# EAGLE design motor-1 (EAGLE 6.5.0)
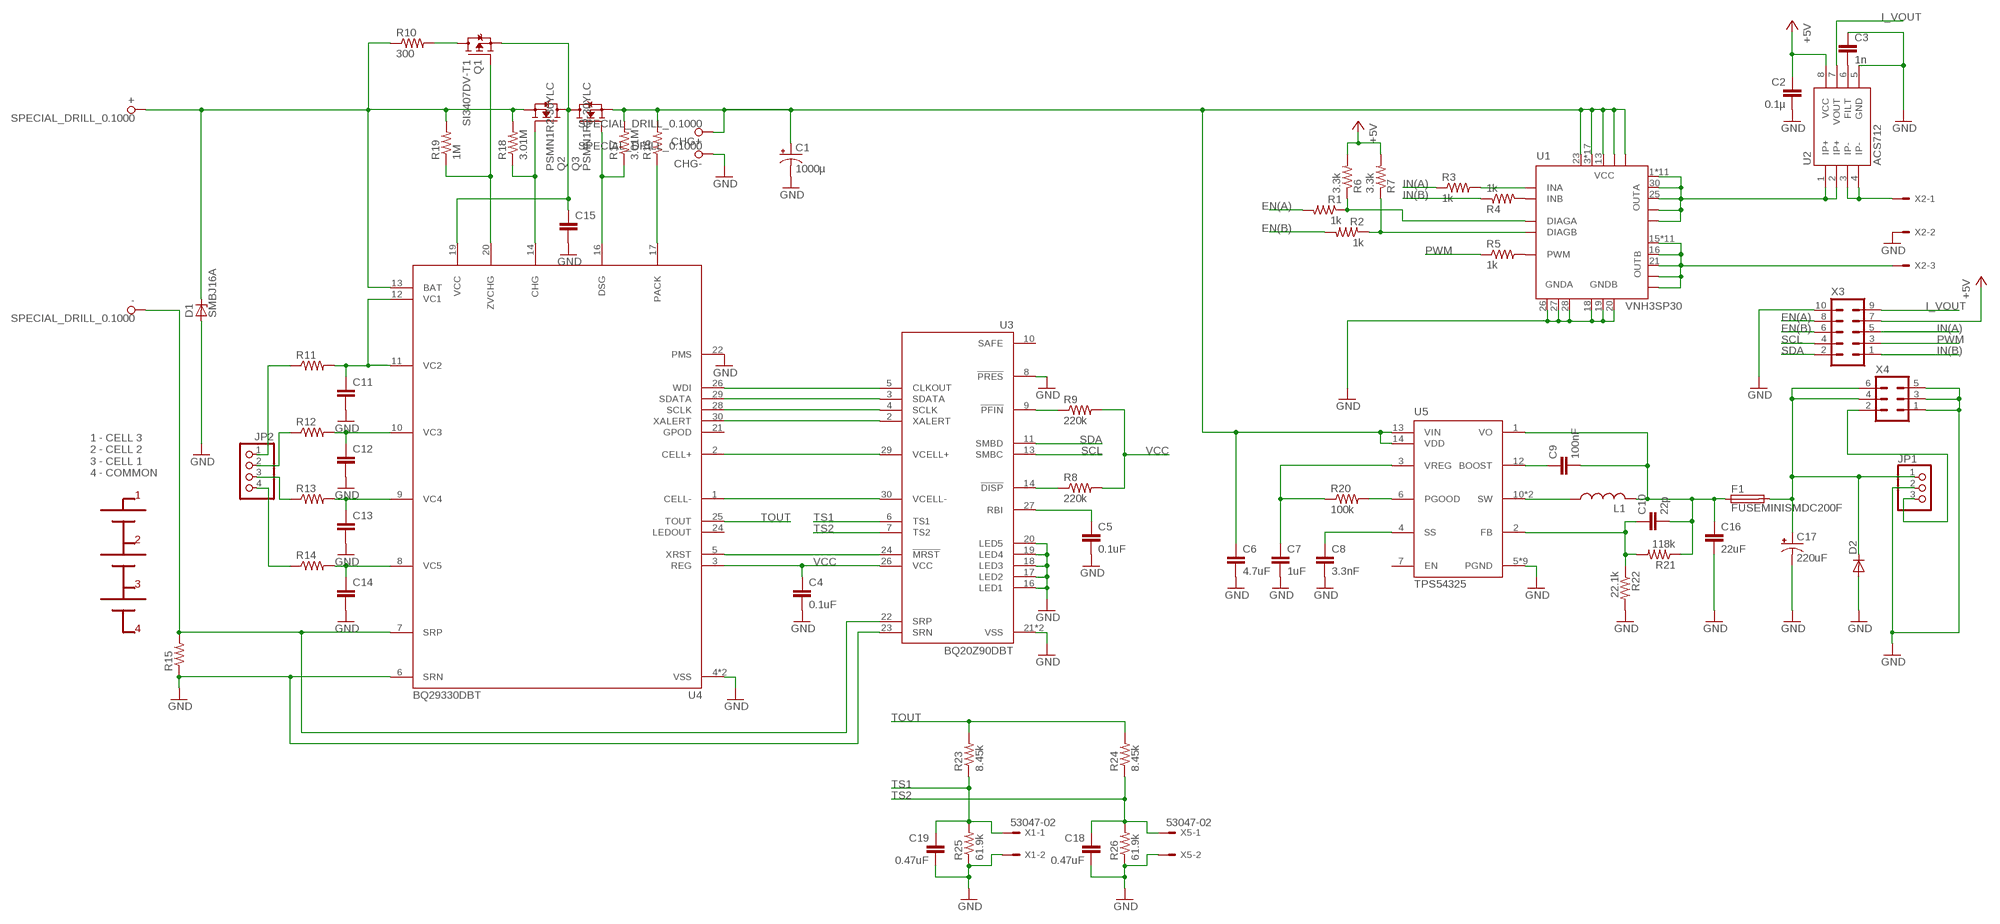
[diagram p0: schematic, sheet 1]

## Parts
+  SPECIAL_DRILL_0.1000  [PAD_0.1000]
-  SPECIAL_DRILL_0.1000  [PAD_0.1000]
C1  1000µ  CPOL-USE5-13  [E5-13]
C2  0.1µ  C-EUC0805  [C0805]
C3  1n  C-EUC0805  [C0805]
C4  0.1uF  C-EUC0603  [C0603]
C5  0.1uF  C-EUC0603  [C0603]
C6  4.7uF  C-EUC1206  [C1206]
C7  1uF  C-EUC0805  [C0805]
C8  3.3nF  C-EUC0805  [C0805]
C9  100nF  C-EUC0805  [C0805]
C10  22p  C-EUC0805  [C0805]
C11  C-EUC0603  [C0603]
C12  C-EUC0603  [C0603]
C13  C-EUC0603  [C0603]
C14  C-EUC0603  [C0603]
C15  C-EUC0603  [C0603]
C16  22uF  C-EUC3225  [C3225]
C17  220uF  CPOL-USE3.5-8  [E3,5-8]
C18  0.47uF  C-EUC0603  [C0603]
C19  0.47uF  C-EUC0603  [C0603]
CHG+  SPECIAL_DRILL_0.1000  [PAD_0.1000]
CHG-  SPECIAL_DRILL_0.1000  [PAD_0.1000]
D1  SMBJ16A  ZENER-DIODESMB  [SMB]
D2  DIODE-DO214AC  [DO214AC]
F1  FUSEMINISMDC200F  [MINISMDC200F]
JP1  PINHD-1X3  [1X03]
JP2  PINHD-1X4  [1X04]
L1  L-USXAL50XX  [XAL50XX]
Q1  SI3407DV-T1  [SOT23-6]
Q2  PSMN1R2-30YLC  [LFPAK]
Q3  PSMN1R2-30YLC  [LFPAK]
R1  1k  R-US_R0805  [R0805]
R2  1k  R-US_R0805  [R0805]
R3  1k  R-US_R0805  [R0805]
R4  1k  R-US_R0805  [R0805]
R5  1k  R-US_R0805  [R0805]
R6  3.3k  R-US_R0805  [R0805]
R7  3.3k  R-US_R0805  [R0805]
R8  220k  R-US_R0603  [R0603]
R9  220k  R-US_R0603  [R0603]
R10  300  R-US_R2512  [R2512]
R11  R-US_R0603  [R0603]
R12  R-US_R0603  [R0603]
R13  R-US_R0603  [R0603]
R14  R-US_R0603  [R0603]
R15  R-US_R1210  [R1210]
R16  R-US_R0603  [R0603]
R17  3.01M  R-US_R0603  [R0603]
R18  3.01M  R-US_R0603  [R0603]
R19  1M  R-US_R0603  [R0603]
R20  100k  R-US_R0805  [R0805]
R21  118k  R-US_R0805  [R0805]
R22  22.1k  R-US_R0805  [R0805]
R23  8.45k  R-US_R0603  [R0603]
R24  8.45k  R-US_R0603  [R0603]
R25  61.9k  R-US_R0603  [R0603]
R26  61.9k  R-US_R0603  [R0603]
U1  VNH3SP30  [MULTIPOWERSO-30]
U2  ACS712  [SO08]
U3  BQ20Z90DBT  [DBT_R-PDSO-G30]
U4  BQ29330DBT  [DBT_R-PDSO-G30]
U5  TPS54325  [HTSSOP14PWP]
X1  53047-02  [53047-02]
X2  KK-156-3  [KK-156-3]
X3  ML10  [ML10]
X4  ML6  [ML6]
X5  53047-02  [53047-02]

## Nets
+5V: C2.1 R6.2 R7.2 U2.8(VCC) X3.7
EN(A): R1.2 X3.8
EN(B): R2.2 X3.6
GND: C1.- C2.2 C3.1 C4.2 C5.2 C6.2 C7.2 C8.2 C11.2 C12.2 C13.2 C14.2 C15.2 C16.2 C17.- C18.2 C19.2 CHG-.1 D1.A D2.A JP1.2 R15.1 R22.2 R25.1 R26.1 U1.18(GNDB) U1.19(GNDB) U1.20(GNDB) U1.26(GNDA) U1.27(GNDA) U1.28(GNDA) U2.5(GND) U3.8(!PRES) U3.16(LED1) U3.17(LED2) U3.18(LED3) U3.19(LED4) U3.20(LED5) U3.21(VSS) U3.23(SRN) U3.25(VSS) U4.4(VSS) U4.6(SRN) U4.22(PMS) U4.23(VSS) U5.5(PGND) U5.8(PGND) U5.9(PGND) U5.EXP1(PGND) U5.EXP(PGND) U5.P$1(PGND) U5.P$2(PGND) U5.P$3(PGND) U5.P$4(PGND) X1.2 X2.2 X3.10 X4.1 X4.3 X4.5 X5.2
GND_P: -.1 R15.2 U3.22(SRP) U4.7(SRP)
I_VOUT: U2.7(VOUT) X3.9
IN(A): R3.1 X3.5
IN(B): R4.1 X3.1
N$1 [power]: U1.15(OUTB) U1.16(OUTB) U1.21(OUTB) U1.OUTB U1.OUTB1(OUTB) U1.OUTB2(OUTB) U1.OUTB3(OUTB) U1.OUTB4(OUTB) U1.OUTB5(OUTB) U1.OUTB6(OUTB) U1.OUTB7(OUTB) U1.OUTB8(OUTB) U1.OUTB9(OUTB) U1.OUTB10(OUTB) U1.OUTB@1(OUTB) X2.3
N$2 [power]: U1.1(OUTA) U1.25(OUTA) U1.30(OUTA) U1.OUTA U1.OUTA1(OUTA) U1.OUTA2(OUTA) U1.OUTA3(OUTA) U1.OUTA4(OUTA) U1.OUTA5(OUTA) U1.OUTA6(OUTA) U1.OUTA7(OUTA) U1.OUTA8(OUTA) U1.OUTA9(OUTA) U1.OUTA10(OUTA) U1.OUTA@1(OUTA) U2.1(IP+) U2.2(IP+)
N$3: R3.2 U1.5(INA)
N$4: R4.2 U1.11(INB)
N$6: U3.5(CLKOUT) U4.26(WDI)
N$7: R1.1 R6.1 U1.6(DIAGA)
N$8: R2.1 R7.1 U1.10(DIAGB)
N$9: U2.3(IP-) U2.4(IP-) X2.1
N$10: U3.3(SDATA) U4.29(SDATA)
N$11: C3.2 U2.6(FILT)
N$12: U3.4(SCLK) U4.28(SCLK)
N$13: U3.2(XALERT) U4.30(XALERT)
N$14: U3.29(VCELL+) U4.2(CELL+)
N$15: U3.30(VCELL-) U4.1(CELL-)
N$16: U3.24(!MRST) U4.5(XRST)
N$17: C17.+ D2.C F1.2 JP1.1 X4.4 X4.6
N$18: R5.2 U1.8(PWM)
N$19: JP2.2 R12.1
N$20: JP2.1 R11.1
N$21: C11.1 R11.2 U4.11(VC2) U4.12(VC1)
N$22: C12.1 R12.2 U4.10(VC3)
N$23: JP2.3 R13.1
N$24: C13.1 R13.2 U4.9(VC4)
N$25: JP2.4 R14.1
N$26: C14.1 R14.2 U4.8(VC5)
N$27: R16.1 U4.17(PACK)
N$28: Q1.1(D1) Q1.2(D1) Q1.5(D1) Q1.6(D1) R10.2
N$29: C5.1 U3.27(RBI)
N$30: Q3.4(G) R17.1 U4.16(DSG)
N$31: C15.1 Q1.4(S1) Q2.P$1(D) Q2.P$2(D) Q2.P$3(D) Q3.P$1(D) Q3.P$2(D) Q3.P$3(D) U4.19(VCC)
N$32: Q2.4(G) R18.1 U4.14(CHG)
N$33: Q1.3(G1) R19.1 U4.20(ZVCHG)
N$34: +.1 D1.C Q2.1(S) Q2.2(S) Q2.3(S) R10.1 R18.2 R19.2 U4.13(BAT)
N$35: R8.1 U3.14(!DISP)
N$36: R9.1 U3.9(!PFIN)
N$37: C7.1 R20.1 U5.3(VREG)
N$38: R20.2 U5.6(PGOOD)
N$39: C8.1 U5.4(SS)
N$40: L1.1 U5.10(SW) U5.11(SW)
N$41: C9.2 C10.2 C16.1 F1.1 L1.2 R21.1 U5.1(VO)
N$42: C9.1 U5.12(BOOST)
N$43: C10.1 R21.2 R22.1 U5.2(FB)
PWM: R5.1 X3.3
S_CTL: JP1.3 X4.2
SCL: U3.13(SMBC) X3.4
SDA: U3.11(SMBD) X3.2
TOUT: R23.2 R24.2 U4.25(TOUT)
TS1: C19.1 R23.1 R25.2 U3.6(TS1) X1.1
TS2: C18.1 R24.1 R26.2 U3.7(TS2) X5.1
VBAT: C1.+ C6.1 CHG+.1 Q3.1(S) Q3.2(S) Q3.3(S) R16.2 R17.2 U1.3(VCC) U1.13(VCC) U1.23(VCC) U1.VCC U1.VCC1(VCC) U1.VCC2(VCC) U1.VCC3(VCC) U1.VCC4(VCC) U1.VCC5(VCC) U1.VCC6(VCC) U1.VCC7(VCC) U1.VCC8(VCC) U1.VCC9(VCC) U1.VCC10(VCC) U1.VCC11(VCC) U1.VCC12(VCC) U1.VCC13(VCC) U1.VCC14(VCC) U1.VCC15(VCC) U1.VCC16(VCC) U1.VCC@1(VCC) U5.13(VIN) U5.14(VDD)
VCC: C4.1 R8.2 R9.2 U3.26(VCC) U4.3(REG)
Unconnected: U3.10(SAFE) U4.21(GPOD) U4.24(LEDOUT) U5.7(EN)

## Notes on the sheet
- 1 - CELL 3
  2 - CELL 2
  3 - CELL 1
  4 - COMMON
- 1
- 2
- 3
- 4

## Library data of the parts
+ - CHG+ CHG- = special-drill:SPECIAL_DRILL_: Special drills
C1 C17 = rcl:CPOL-US: POLARIZED CAPACITOR, American symbol
C2-C16 C18 C19 = rcl:C-EU: CAPACITOR, European symbol
D1 = diode:ZENER-DIODE: Z-Diode
D2 = diode:DIODE-: DIODE
F1 = miniSMDC200F:FUSE
JP1 = pinhead:PINHD-1X3: PIN HEADER
JP2 = pinhead:PINHD-1X4: PIN HEADER
L1 = inductors:L-US: INDUCTOR, American symbol
Q1 = transistors:SI3407DV
Q2 Q3 = transistors:PSMN1R2-30YLC
R1-R26 = rcl:R-US_: RESISTOR, American symbol
U1 = VNH3SP30:VNH3SP30: FULLY INTEGRATED H-BRIDGE MOTOR DRIVER Source: http://pdf1.alldatasheet.com/datasheet-pdf/view/84563/STMICROELECTRONICS/VNH3SP30.html; MPN: VNH3SP30-E; OC_FARNELL: 1739420; OC_NEWARK: 33R1486
U2 = SparkFun-AnalogIC:ACS712: Hall-effect-based isolated linear current sensor
U3 = texas-1:BQ20Z90
U4 = texas-1:BQ29330
U5 = TPS54325:TPS54325
X1 X5 = con-molex:53?-02: CONNECTOR wire to board 1.25 mm (.049 inch) pitch header; MF: MOLEX; MPN: 53047-0210; OC_FARNELL: 9733051; OC_NEWARK: 57H4701
X2 = con-molex:KK-156-3: KK 156 HEADER Source: http://www.molex.com/pdm_docs/sd/026604100_sd.pdf; OC_FARNELL: unknown; OC_NEWARK: unknown
X3 = con-ml:ML10: HARTING; OC_FARNELL: unknown; OC_NEWARK: unknown
X4 = con-harting-ml:ML6: HARTING; OC_FARNELL: unknown; OC_NEWARK: unknown

## Net classes
1 power: clearance 0.003 mm

## Board
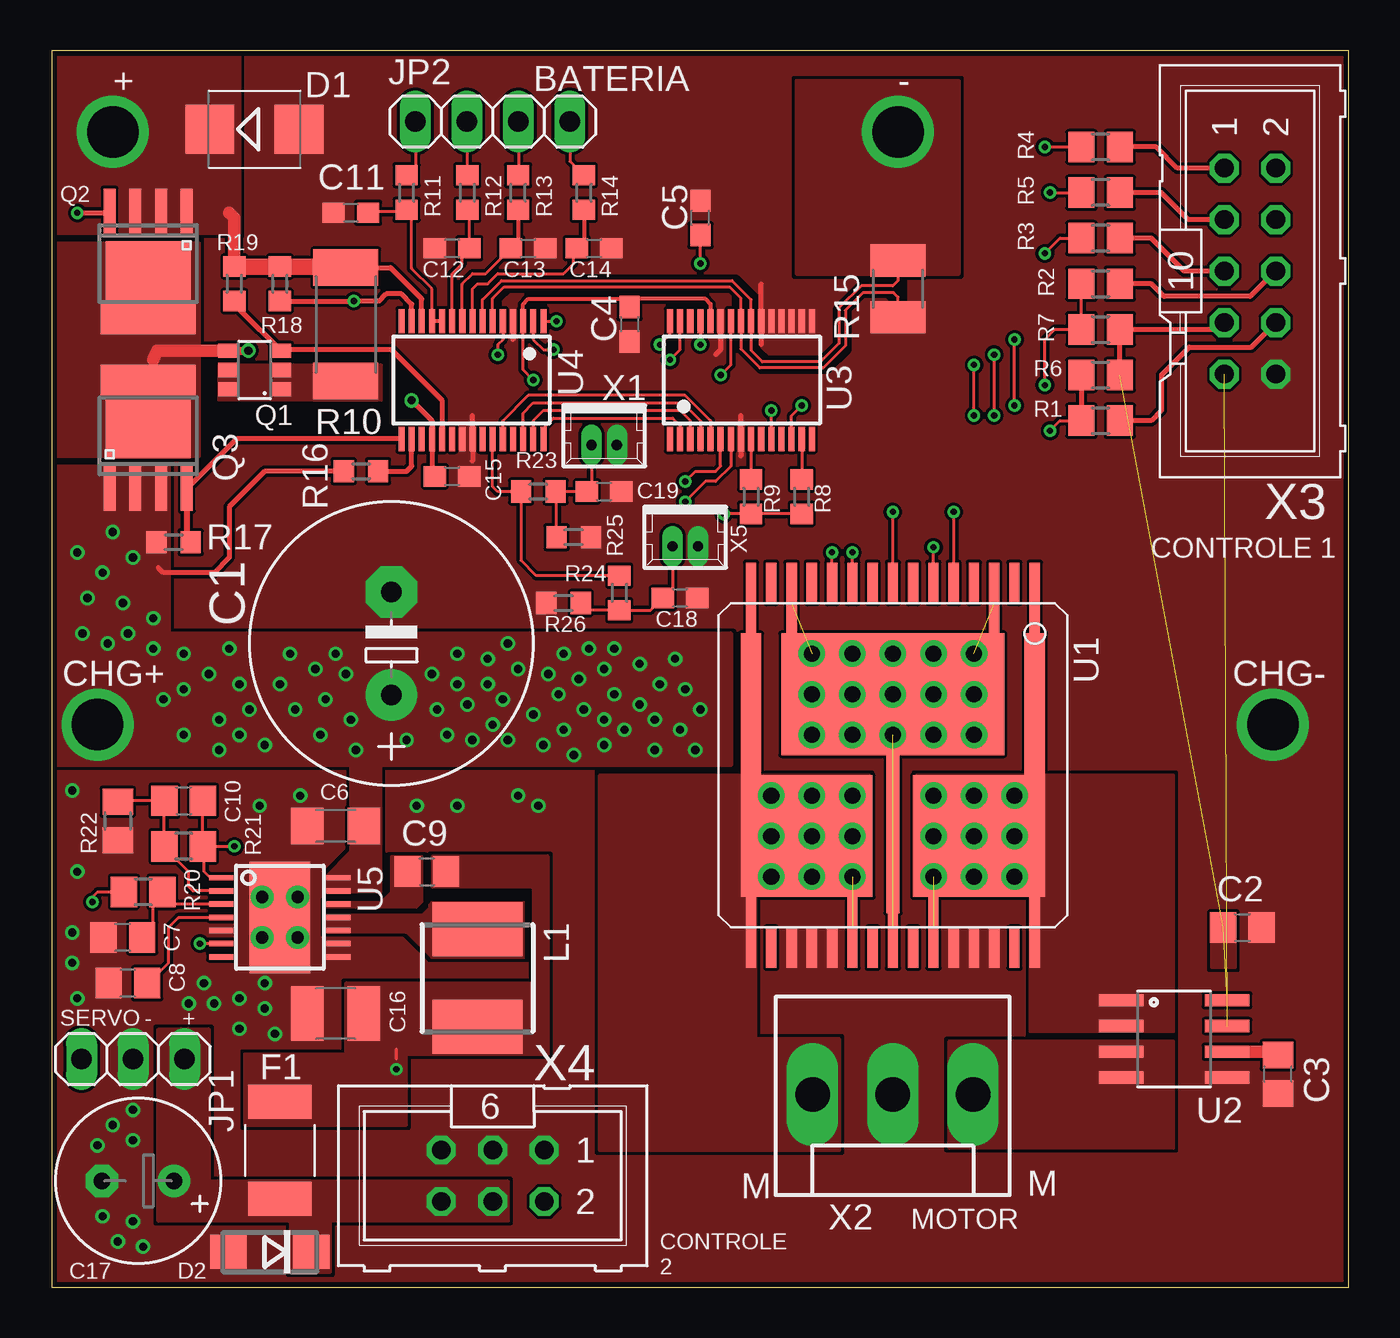
[diagram p1: board, top side]
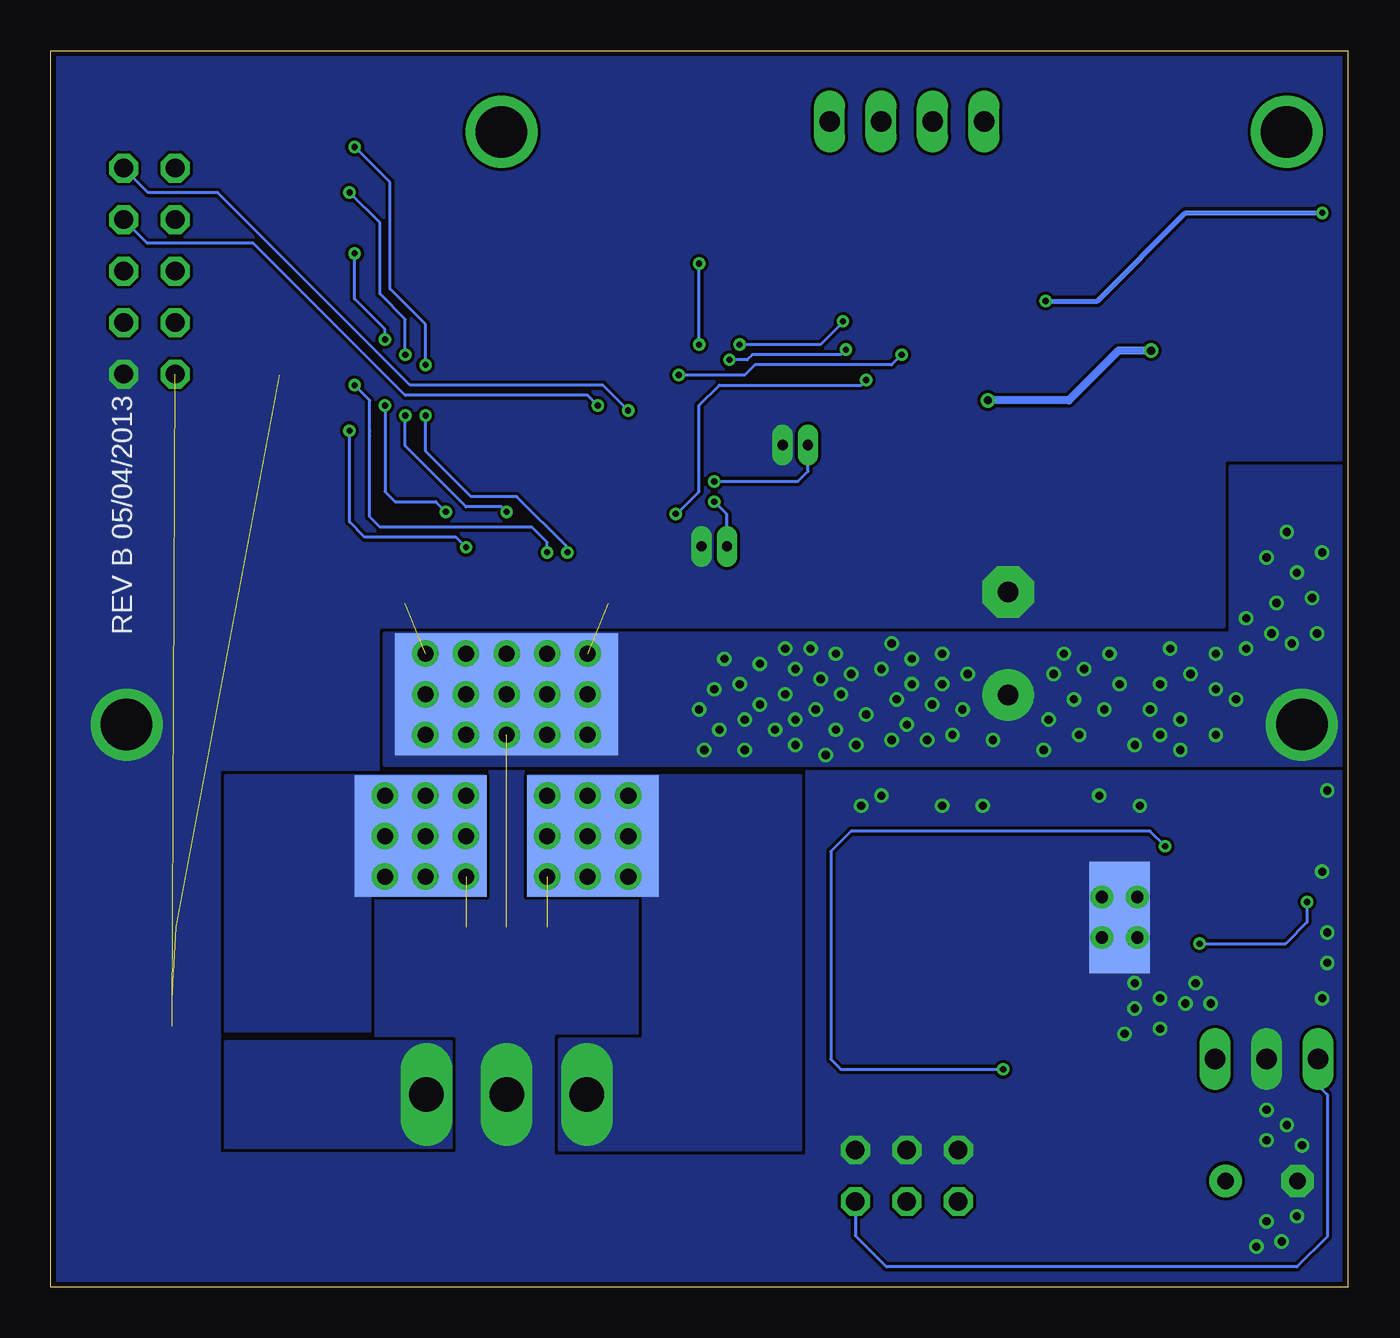
[diagram p2: board, bottom side, seen from below]

Size 64 x 61 mm. Coordinates in mm from the lower left corner, seen from the top.
Outline: 64,0 64,61 0,61 0,0 64,0
Copper layers (1*16): Top 0.035mm / dielectric 1.5mm / Bottom 0.035mm
Design rules "Fusion_eagle_rule_v1.1": minimum track width 6mil, minimum drill 12mil, track to track 6mil, track to pad 6mil, pad to pad 6mil, via to via 6mil, smd to smd 0mil, copper to edge 10mil, drill to drill 10mil, minimum pad ring 10mil, minimum via ring 6mil, stop-mask expansion 2mil, vias tented up to drill 100mil, thermal gap 10mil
tRestrict: area 21,45.2 to 42,50

### Footprints (pad centres in the part's own frame; a part is rotated, then mirrored left to right if it is on the bottom)
PAD_0.1000 = drill 2.54 pad 2.54: 1 0,0
E5-13 = drill 1.016 pad 2.54: + -2.54,0 | drill 1.016 pad 2.54 octagon: - 2.54,0
C0805 = smd 1.3 x 1.5: 1 -0.95,0; 2 0.95,0
C0603 = smd 1.1 x 1: 1 -0.85,0; 2 0.85,0
C1206 = smd 1.6 x 1.8: 1 -1.4,0; 2 1.4,0
C3225 = smd 1.6 x 2.7: 1 -1.4,0; 2 1.4,0
E3,5-8 = drill 0.813 pad 1.6: + -1.778,0 | drill 0.813 pad 1.6 octagon: - 1.778,0
SMB = smd 2.4 x 2.4: A 2.2,0; C -2.2,0
DO214AC = smd 1.8 x 1.7: A 2.05,0; C -2.05,0
MINISMDC200F = smd 1.68 x 3.15: 1 -2.39,0; 2 2.39,0
1X03 = drill 1.016 long: 1 -2.54,0; 2 0,0; 3 2.54,0
1X04 = drill 1.016 long: 1 -3.81,0; 2 -1.27,0; 3 1.27,0; 4 3.81,0
XAL50XX = smd 2.68 x 4.44: 1 -2.405,0; 2 2.405,0
SOT23-6 = smd 0.7 x 1: 1 -0.95,-1.3; 2 0,-1.3; 3 0.95,-1.3; 4 0.95,1.3; 5 0,1.3; 6 -0.95,1.3
LFPAK = smd 0.6 x 2.2: 1 -1.905,-2.6; 2 -0.635,-2.6; 3 0.635,-2.6; 4 1.905,-2.6 | smd 4.2 x 1.1: P$1 0,-0.55 | smd 4.2 x 2: P$2 0,1 | smd 4.7 x 1.5: P$3 0,2.75
R0805 = smd 1.3 x 1.5: 1 -0.95,0; 2 0.95,0
R0603 = smd 1 x 1.1: 1 -0.85,0; 2 0.85,0
R2512 = smd 1.8 x 3.2: 1 -2.8,0; 2 2.8,0
R1210 = smd 1.6 x 2.7: 1 -1.4,0; 2 1.4,0
MULTIPOWERSO-30 = smd 0.508 x 12: 1 -7,-4; 15 7,-4; 16 7,4; 30 -7,4 | smd 0.508 x 2: 2 -6,-9; 4 -4,-9; 5 -3,-9; 6 -2,-9; 7 -1,-9; 8 0,-9; 9 1,-9; 10 2,-9; 11 3,-9; 12 4,-9; 14 6,-9; 17 6,9; 18 5,9; 19 4,9; 20 3,9; 22 1,9; 24 -1,9; 26 -3,9; 27 -4,9; 28 -5,9; 29 -6,9 | smd 0.508 x 4: 3 -5,-8; 13 5,-8; 21 2,8; 23 0,8; 25 -2,8 | smd 6.5 x 6 bottom: OUTA -4.25,3.5; OUTB 4.25,3.5 | smd 6.5 x 6: OUTA1 -4.25,3.5; OUTB1 4.25,3.5 | drill 0.8: OUTA2 -6,5.5; OUTA3 -4,5.5; OUTA4 -2,5.5; OUTA5 -6,3.5; OUTA6 -4,3.5; OUTA7 -2,3.5; OUTA8 -2,1.5; OUTA9 -4,1.5; OUTA10 -6,1.5; OUTB2 2,5.5; OUTB3 4,5.5; OUTB4 6,5.5; OUTB5 6,3.5; OUTB6 4,3.5; OUTB7 2,3.5; OUTB8 2,1.5; OUTB9 4,1.5; OUTB10 6,1.5; VCC2 -4,-1.5; VCC3 -2,-1.5; VCC4 0,-1.5; VCC5 2,-1.5; VCC6 4,-1.5; VCC7 4,-3.5; VCC8 2,-3.5; VCC9 0,-3.5; VCC10 -2,-3.5; VCC11 -4,-3.5; VCC12 -4,-5.5; VCC13 -2,-5.5; VCC14 0,-5.5; VCC15 2,-5.5; VCC16 4,-5.5 | smd 1 x 7.5: OUTA@1 -7,-2.755; OUTB@1 7,-2.755 | smd 11 x 6 bottom: VCC 0,-3.5 | smd 11 x 6: VCC1 0,-3.5 | smd 0.65 x 8.3: VCC@1 0,3.145
SO08 = smd 0.61 x 2.21: 1 -1.905,-2.616; 2 -0.635,-2.616; 3 0.635,-2.616; 4 1.905,-2.616; 5 1.905,2.616; 6 0.635,2.616; 7 -0.635,2.616; 8 -1.905,2.616
DBT_R-PDSO-G30 = smd 0.3 x 1.2: 1 -3.5,-2.9; 2 -3,-2.9; 3 -2.5,-2.9; 4 -2,-2.9; 5 -1.5,-2.9; 6 -1,-2.9; 7 -0.5,-2.9; 8 0,-2.9; 9 0.5,-2.9; 10 1,-2.9; 11 1.5,-2.9; 12 2,-2.9; 13 2.5,-2.9; 14 3,-2.9; 15 3.5,-2.9; 16 3.5,2.9; 17 3,2.9; 18 2.5,2.9; 19 2,2.9; 20 1.5,2.9; 21 1,2.9; 22 0.5,2.9; 23 0,2.9; 24 -0.5,2.9; 25 -1,2.9; 26 -1.5,2.9; 27 -2,2.9; 28 -2.5,2.9; 29 -3,2.9; 30 -3.5,2.9
HTSSOP14PWP = smd 0.27 x 1.2: 1 -1.95,-2.9; 2 -1.3,-2.9; 3 -0.65,-2.9; 4 0,-2.9; 5 0.65,-2.9; 6 1.3,-2.9; 7 1.95,-2.9; 8 1.95,2.9; 9 1.3,2.9; 10 0.65,2.9; 11 0,2.9; 12 -0.65,2.9; 13 -1.3,2.9; 14 -1.95,2.9 | smd 5.5 x 3 bottom: EXP 0,0 | smd 5.5 x 3: EXP1 0,0 | drill 0.61: P$1 -1,0.875; P$2 -1,-0.875; P$3 1,-0.875; P$4 1,0.875
53047-02 = drill 0.5 pad 0.698 long: 1 0.625,0.45; 2 -0.625,0.45
KK-156-3 = drill 1.7 pad 2.184 long: 1 -3.96,0; 2 0,0; 3 3.96,0
ML10 = drill 0.914 octagon: 1 -5.08,-1.27; 2 -5.08,1.27; 3 -2.54,-1.27; 4 -2.54,1.27; 5 0,-1.27; 6 0,1.27; 7 2.54,-1.27; 8 2.54,1.27; 9 5.08,-1.27; 10 5.08,1.27
ML6 = drill 0.914 octagon: 1 -2.54,-1.27; 2 -2.54,1.27; 3 0,-1.27; 4 0,1.27; 5 2.54,-1.27; 6 2.54,1.27

### Placement (x,y rotation side)
+  3,57 0 top
-  41.75,57 0 top
C1  16.75,31.75 90 top
C2  58.75,17.75 0 top
C3  60.5,10.5 90 top
C4  28.5,47.5 270 top
C5  32,52.75 90 top
C6  14,22.75 180 top
C7  3.5,17.25 180 top
C8  3.75,15 180 top
C9  18.5,20.5 0 top
C10  6.5,24 0 top
C11  14.75,53 180 top
C12  19.75,51.25 180 top
C13  23.5,51.25 0 top
C14  26.75,51.25 0 top
C15  19.75,40 0 top
C16  14,13.5 180 top
C17  4.25,5.25 180 top
C18  31,34 0 top
C19  27.25,39.25 0 top
CHG+  2.25,27.75 0 top
CHG-  60.25,27.75 0 top
D1  10,57.12 0 top
D2  10.75,1.75 180 top
F1  11.25,6.75 270 top
JP1  4,11.25 180 top
JP2  21.75,57.5 0 top
L1  21,15.25 270 top
Q1  10,45.25 90 top
Q2  4.75,50.5 180 top
Q3  4.75,42 0 top
R1  51.75,42.75 0 top
R2  51.75,49.5 0 top
R3  51.75,51.75 180 top
R4  51.75,56.25 180 top
R5  51.75,54 180 top
R6  51.75,45 0 top
R7  51.75,47.25 0 top
R8  37,39 270 top
R9  34.5,39 270 top
R10  14.5,47.5 270 top
R11  17.5,54 270 top
R12  20.5,54 270 top
R13  23,54 270 top
R14  26.25,54 270 top
R15  41.75,49.25 90 top
R16  15.25,40.25 180 top
R17  6,36.75 180 top
R18  11.25,49.5 90 top
R19  9,49.5 90 top
R20  4.5,19.5 180 top
R21  6.5,21.75 180 top
R22  3.25,23 270 top
R23  24,39.25 180 top
R24  28,34.25 90 top
R25  25.75,37 180 top
R26  25.25,33.75 0 top
U1  41.5,25.75 180 top
U2  55.38,12.25 270 top
U3  34,44.75 0 top
U4  20.75,44.75 180 top
U5  11.25,18.25 270 top
X1  27.25,42 180 top
X2  41.5,9.5 180 top
X3  59.12,50.12 270 top
X4  21.75,5.5 180 top
X5  31.25,37 180 top

### Tracks (layer width: path | path; a pad name or v marks a point on that pad's centre or on a via)
+5V  (2 unrouted)
  Top 0.254: X3.7 57.52,47.25 R7.2 R6.2
  pour Top (isolate 0.254, no thermals): 57.25,18.38 58.38,18.38 58.38,15.75 57.25,15.75
EN(A)
  Top 0.254: X3.8 59.19,46.38 56.12,46.38 54.75,45 54.75,43.25 54.25,42.75 R1.2
EN(B)
  Top 0.254: X3.6 60.38,50.12 59.12,48.88 54.88,48.88 54.25,49.5 R2.2
GND  (via drill 0.41)
  Top 0.152: R15.1 41.75,48.85 41.53,49.07 40.03,49.07 39.15,48.19 39.15,46.44 38.06,45.35 34.94,45.35 34,46.28 U3.23 34,48.78 33.44,49.35 22.31,49.35 21.75,48.78 U4.6
  Top 0.254: 20.75,40.75 U4.23 20.75,43 | U4.4 22.75,46.75 | 35,46.5 U3.21 35,49.5 | U3.25 33,46.25 32.75,46 | 34,41 U3.8 34,43
  other vias: 10.25,23.75 12.25,24.25 1,24.5 1.25,20.5 1,16 1,17.5 1.25,14.25 8,14 9.25,12.75 9.25,14.25 11,12.5 10.5,13.75 7.5,15 4.5,2 3.25,2.25 2.5,3.5 4,3.25 2.25,7 4,7.25 3,8 4,8.75 10.5,15 6.75,14 18,23.75 20,23.75 23,24.25 24,23.75
  pour Top (isolate 0.13, rank 6, no thermals): 0,0 64,0 64,61 0,61
  pour Bottom (isolate 0.13, rank 6, no thermals): 0,0 64,0 64,61 0,61
GND_P
  Top 0.152: R15.2 41.75,49.65 41.5,49.4 39.94,49.4 38.85,48.31 38.85,46.56 37.94,45.65 35.06,45.65 34.5,46.22 U3.22 34.5,48.72 33.56,49.65 22.19,49.65 21.25,48.72 U4.7
  pour Top (no thermals): 36.75,50 44.75,50 44.75,59.5 36.75,59.5
I_VOUT  (1 unrouted)
IN(A)
  Top 0.254: X3.5 55.88,50.12 54.25,51.75 R3.1
IN(B)
  Top 0.254: X3.1 55.55,55.2 54.5,56.25 R4.1
N$1  (1 unrouted)
  pour Bottom (isolate 0.13, rank 2, no thermals): 40.38,25.25 27,25.25 27,6.75 38.88,6.75 38.88,12.25 34.75,12.25 34.75,20.38 40.38,20.38
  pour Top (isolate 0.13, rank 2, no thermals): 40.38,25.25 27,25.25 27,6.75 38.88,6.75 38.88,12.25 34.75,12.25 34.75,20.38 40.38,20.38
N$2  (1 unrouted)
  pour Bottom (isolate 0.13, no thermals): 42.62,25.25 42.62,20.38 48.25,20.38 48.25,12.62 55.38,12.62 55.38,25.25
  pour Top (isolate 0.13, no thermals): 42.62,25.25 42.62,20.38 48.25,20.38 48.25,12.62 55.38,12.62 55.38,25.25
N$3  (via drill 0.3)
  Top 0.152: U1.5 v44.5,38.25 | v47.5,43.5 v47.5,46.75 | v49,51 49.75,51.75 R3.2
  Bottom 0.152: v49,51 49,48.75 47.5,47.25 v47.5,46.75 | v47.5,43.5 47.5,39.25 47,38.75 45,38.75 v44.5,38.25
N$4  (via drill 0.3)
  Top 0.152: U1.11 v38.5,36.25 | v45.5,43 v45.5,45.5 | v49,56.25 R4.2
  Bottom 0.152: v38.5,36.25 38.5,36.5 41,39 43.25,39 45.5,41.25 v45.5,43 | v45.5,45.5 45.5,47.5 47.25,49.25 47.25,54.5 v49,56.25
N$6
  Top 0.152: U4.26 22.25,42.75 23.5,44 31.25,44 32.5,42.75 U3.5
N$7  (via drill 0.3)
  Top 0.152: U1.6 v43.5,36.5 | v49.25,42.25 49.75,42.75 R1.1
  Top 0.254: R6.1 R1.1
  Bottom 0.152: v43.5,36.5 44,37 48.5,37 49.25,37.75 v49.25,42.25
N$8  (via drill 0.3)
  Top 0.152: R2.1 R7.1 49.5,47.25 49,46.75 v49,44.5 | U1.10 v39.5,36.25
  Bottom 0.152: v39.5,36.25 39.5,36.75 40.25,37.5 47.75,37.5 48.25,38 48.25,42 48.25,42.25 48.25,43.75 v49,44.5
N$9
  pour Top (isolate 0.13, no thermals): 44.25,6.88 55.38,6.88 55.38,12.12 44.25,12.12
  pour Bottom (isolate 0.13, no thermals): 44.25,6.88 55.38,6.88 55.38,12.12 44.25,12.12
N$10
  Top 0.152: U3.3 31.5,42.75 31,43.25 24.25,43.25 23.75,42.75 U4.29
N$11
  Top 0.61: U2.6 60.34,11.62 C3.2
N$12
  Top 0.152: 23.25,42.75 U4.28 23.25,43.12 23.75,43.62 31.12,43.62 32,42.75 U3.4
N$13
  Top 0.152: U4.30 24.25,42.38 24.75,42.88 30.62,42.88 31,42.5 U3.2
N$14  (via drill 0.3)
  Top 0.152: v30.5,45.75 31,46.25 U3.29 | U4.2 23.75,46.75 24.25,46.25 v24.75,46.25
  Bottom 0.152: v30.5,45.75 29.62,45.75 29.38,46 25,46 v24.75,46.25
N$15  (via drill 0.3)
  Top 0.152: U4.1 v24.9,47.65 | v30,46.5 30.5,47 U3.30
  Bottom 0.152: v24.9,47.65 24.9,47.6 26,46.5 v30,46.5
N$16  (via drill 0.3)
  Top 0.152: v33,45 33.5,45.5 U3.24 | U4.5 22.25,46.75 22,46.5 v22,46
  Bottom 0.152: v33,45 29.75,45 29.25,45.5 22.5,45.5 v22,46
N$17
  pour Top (no thermals): 7.75,5.25 22.5,5.25 22.5,3.25 5.25,3.25 5.25,12.75 7.75,12.75
  pour Top (no thermals): 12,0.75 13.75,0.75 13.75,3.25 11.75,3.25 11.75,0.75
N$18  (via drill 0.3)
  Top 0.152: U1.8 v41.5,38.25 | v46.5,43 v46.5,46 | v49.25,54 R5.2
  Bottom 0.152: v41.5,38.25 41.75,38.5 43.5,38.5 46.5,41.5 v46.5,43 | v46.5,46 46.5,47.75 47.75,49 47.75,52.5 v49.25,54
N$19
  Top 0.152: JP2.2 20.48,54.87 R12.1
  Top 0.203: 20.73,54.87 R12.1
N$20
  Top 0.152: JP2.1 17.94,55.29 R11.1
N$21
  Top 0.152: U4.12 18.75,49.25 17.75,50.25 17.75,52.9 R11.2 | 17.6,53.05 15.65,53.05 C11.1
  Top 0.203: 17.6,53.05 R11.2 | U4.11 U4.12
N$22
  Top 0.152: U4.10 19.75,50 20.25,50.5 20.25,50.9 C12.1 20.6,53.05 R12.2
N$23
  Top 0.152: JP2.3 23.02,54.87 R13.1
N$24
  Top 0.152: U4.9 20.25,49.5 20.75,50 21.4,50 C13.1
  Top 0.203: R13.2 23,51.6 C13.1
N$25
  Top 0.152: JP2.4 25.56,55.54 R14.1
N$26
  Top 0.152: U4.8 20.75,49.25 21,49.5 21.5,49.5 22,50 25.25,50 25.75,50.5 25.75,51.1 C14.1
  Top 0.203: R14.2 26.25,51.6 C14.1
N$27
  Top 0.254: R16.1 17.5,40.25 17.75,40.5 U4.17
N$28
  pour Top (no thermals): 8.25,45.5 16.25,45.5 16.25,43.75 8.25,43.75
N$29  (via drill 0.3)
  Top 0.152: U3.27 v32,46.5 | v32,50.5 C5.1
  Bottom 0.152: v32,46.5 v32,50.5
N$30
  Top 0.254: Q3.4 9.11,41.85 U4.16
  Top 0.305: Q3.4 6.66,36.95 R17.1
N$31  (via drill 0.41)
  Top 0.254: 18.75,39.9 U4.19 18.75,42.75 v17.75,43.75
  Top 0.305: 18.75,39.9 C15.1
  Top 0.406: Q1.4 v9.7,46.2
  Top 0.61: Q1.4 5.2,46.2 5,45.75
  Bottom 0.406: v17.75,43.75 13.75,43.75 11.3,46.2 v9.7,46.2
  pour Top (isolate 0.13, no thermals): 7.25,51.5 7.25,41 0,41 0,51.5
N$32  (via drill 0.3)
  Top 0.254: U4.14 17.75,48.5 17.25,49 16.5,49 16.15,48.65 v14.9,48.65 R18.1 | v1.25,53 2.75,53 Q2.4
  Bottom 0.254: v1.25,53 8,53 12.35,48.65 v14.9,48.65
N$33
  Top 0.254: U4.20 19.25,43.75 16.75,46.25 11.35,46.25 Q1.3 9.25,48.25 9.25,48.4 R19.1
N$34
  Top 0.254: U4.13 18.25,48.75 16.7,50.3 R10.1
  Top 0.61: R19.2 9,52.75 8.75,53
  Top 0.813: R10.1 14.45,50.35 R18.2 R19.2
  pour Top (isolate 0.13, no thermals): 9.25,52 0,52 0,60.75 9.25,60.75
N$35
  Top 0.152: U3.14 R8.1
N$36
  Top 0.152: U3.9 R9.1
N$37
  Top 0.152: U5.3 6.05,18.9 R20.1 5,19.05 5,17.75 4.5,17.25 C7.1
N$38  (via drill 0.3)
  Top 0.152: U5.6 v7.3,16.95 | v2,19 2,19.25 2.25,19.5 R20.2
  Bottom 0.152: v7.3,16.95 3.05,16.95 2,18 v2,19
N$39
  Top 0.152: C8.1 4.75,15 5.75,16 5.75,17.75 6.25,18.25 U5.4
N$40
  pour Top (isolate 0.254, rank 2, no thermals): 13.5,18.5 18.25,18.5 18.75,19 23.25,19 23.25,16.25 18.75,16.25 17.5,17.5 13.5,17.5
N$41  (via drill 0.3)
  Top 0.152: U5.1 7.8,20.2 7.5,20.5 7.5,21.7 R21.1 | R21.1 v9,21.75 | 17,11.25 17,11.75 | R21.1 C10.2 | v17,10.75 16.75,10.75
  Bottom 0.152: v9,21.75 9.75,22.5 24.5,22.5 25.5,21.5 25.5,11.25 25,10.75 v17,10.75
  pour Top (no thermals): 18.75,19.75 23.75,19.75 23.75,15 14.5,15 14.5,11.5 24.5,11.5 24.5,21.25 18.75,21.25
  pour Top (no thermals): 9.5,8 17.5,8 17.5,11.5 9.5,11.5
N$42
  pour Top (no thermals): 13.5,19 16.25,19 16.75,19.5 16.75,21.25 18.25,21.25 18.25,19 18,18.75 13.5,18.75
N$43
  Top 0.152: U5.2 6.95,19.55 6.75,19.75 6.75,20.5 5.55,21.7 R21.2 C10.1 3.3,24 R22.1
PWM
  Top 0.254: X3.3 56.09,52.66 54.75,54 R5.1
S_CTL
  Bottom 0.152: JP1.3 1.46,9.96 1,9.5 1,2.5 2.5,1 22.75,1 24.29,2.54 X4.2
SCL  (via drill 0.3)
  Top 0.152: U3.13 36.5,43 v37,43.5
  Bottom 0.152: v37,43.5 37.5,44 46.5,44 54,51.5 59.23,51.5 X3.4
SDA  (via drill 0.3)
  Top 0.152: U3.11 v35.5,43.25
  Bottom 0.152: v35.5,43.25 36.75,44.5 46.25,44.5 55.75,54 59.19,54 X3.2
TOUT
  Top 0.152: R24.2 23.9,35.1 23.15,35.85 R23.2 22,39.25 21.75,39.5 U4.25
TS1  (via drill 0.3)
  Top 0.152: v31.25,39.75 31.75,40.25 32.75,40.25 33,40.5 U3.6 | X1.1 26.62,39.48 C19.1 R23.1 24.9,39.2 R25.2
  Bottom 0.152: v31.25,39.75 27.12,39.75 26.62,40.25 X1.1
TS2  (via drill 0.3)
  Top 0.152: v31.25,38.75 32.25,39.75 32.75,39.75 33.5,40.5 U3.7 | X5.1 30.62,34.48 C18.1 29.55,33.4 R24.1 26.45,33.4 R26.2
  Bottom 0.152: v31.25,38.75 30.62,38.12 X5.1
VBAT  (via drill 0.41)  (4 unrouted)
  Top 0.152: 41.5,28 U1.VCC4
  Top 0.254: 5.25,35.5 5.5,35.25 8,35.25 8.75,36 8.75,38.5 10.5,40.25 R16.2
  other vias: 3,37.25 1.25,36.25 2.5,35.25 4,36 3.75,32.25 5,33 1.5,32.25 2.75,31.75 5,31.5 6.5,31.25 5.5,29 6.5,29.5 6.5,27.25 7.75,30.25 9.75,28.5 8.25,28 11.25,29.75 9.25,27.25 8.25,26.5 12,28.5 10.5,26.75 13.25,27.25 13,30.5 15,26.5 17.5,27 20,29.75 19.5,27.25 20.5,28.75 13.5,29 21.75,27.75 20,31.25 21.5,31 21.5,29.75 27.75,29.25 28.25,27.5 29,30.75 27.75,31.5 29,28.75 29.75,26.5 31.75,26.5 30.75,31 1.75,34 3.5,33.75 23,30.5 30,29.75 31,27.5 32,28.5 14.75,28 14.5,30.25 19,28.5 24.25,26.75 22.5,27 23.75,28.25 25.25,27.5 25,29.25 24.5,30.25 25.25,31.25 26,30 27.25,30.5 26.5,31.5 26.25,28.5 27.25,26.75 25.75,26.25 27.25,28 29.75,28 31.25,29.5 20.75,27 22.5,31.75 22.25,29 11.75,31.25 14,31.25 18.75,30.25 9.25,29.75 8.75,31.5
  pour Top (isolate 0.13, no thermals): 0,40.5 5.75,40.5 5.75,32.25 33.5,32.25 33.5,25.75 0,25.75
  pour Bottom (isolate 0.13, no thermals): 0,25.75 47.5,25.75 47.5,32.25 0,32.25
  pour Bottom (isolate 0.13): 0,32.25 5.75,32.25 5.75,40.5 0,40.5
  pour Top (no thermals): 14.75,25.75 14.75,21.5 13.5,20.25 13.5,19.5 16.25,19.5 16.25,25.75
VCC  (via drill 0.3)
  Top 0.152: R8.2 R9.2 v33.15,38.15 | v23.75,44.75 23.25,45.25 U4.3
  Top 0.203: U4.3 23.25,48.5 23.5,48.75 28.1,48.75 C4.1 28.9,48.75 32.25,48.75 32.5,48.5 U3.26
  Bottom 0.152: v33.15,38.15 33.1,38.15 32,39.25 32,43.5 31,44.5 24,44.5 v23.75,44.75

### Text on the board
tPlace: BATERIA | CONTROLE 1 | SERVO | - | + | M | M | MOTOR | CONTROLE / 2
bPlace: REV B 05/04/2013